# EAGLE board Gameboy Player (EAGLE 9.5.2)
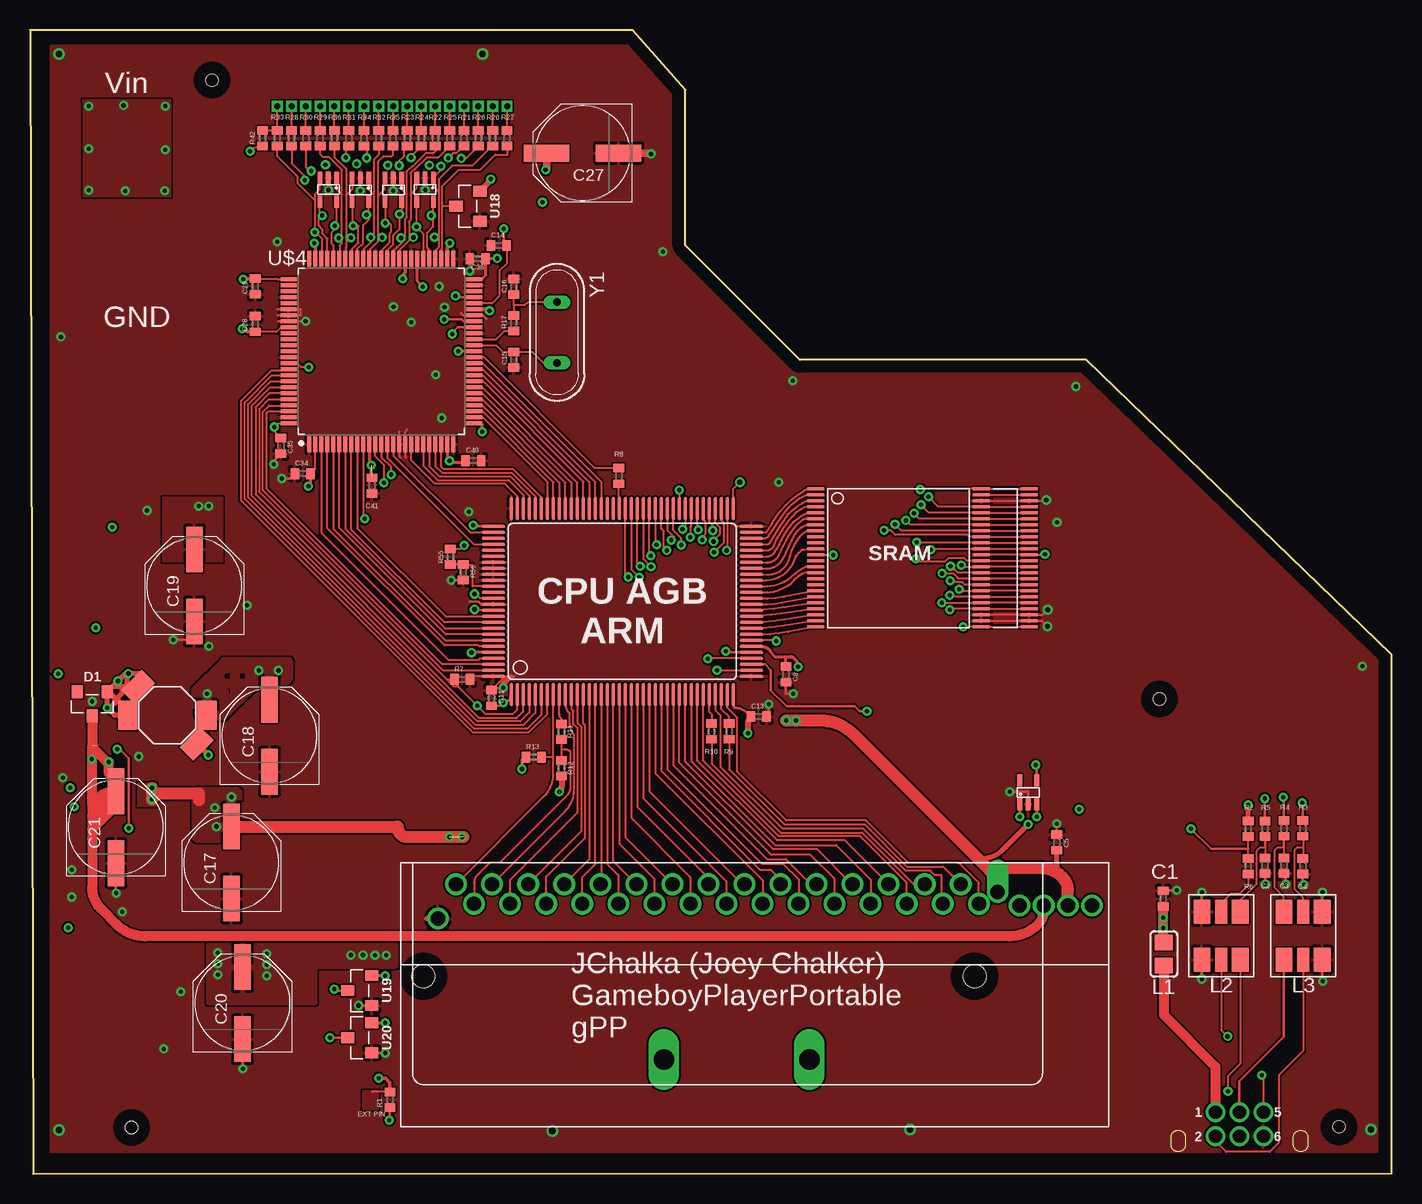
[diagram p2: board, top side]
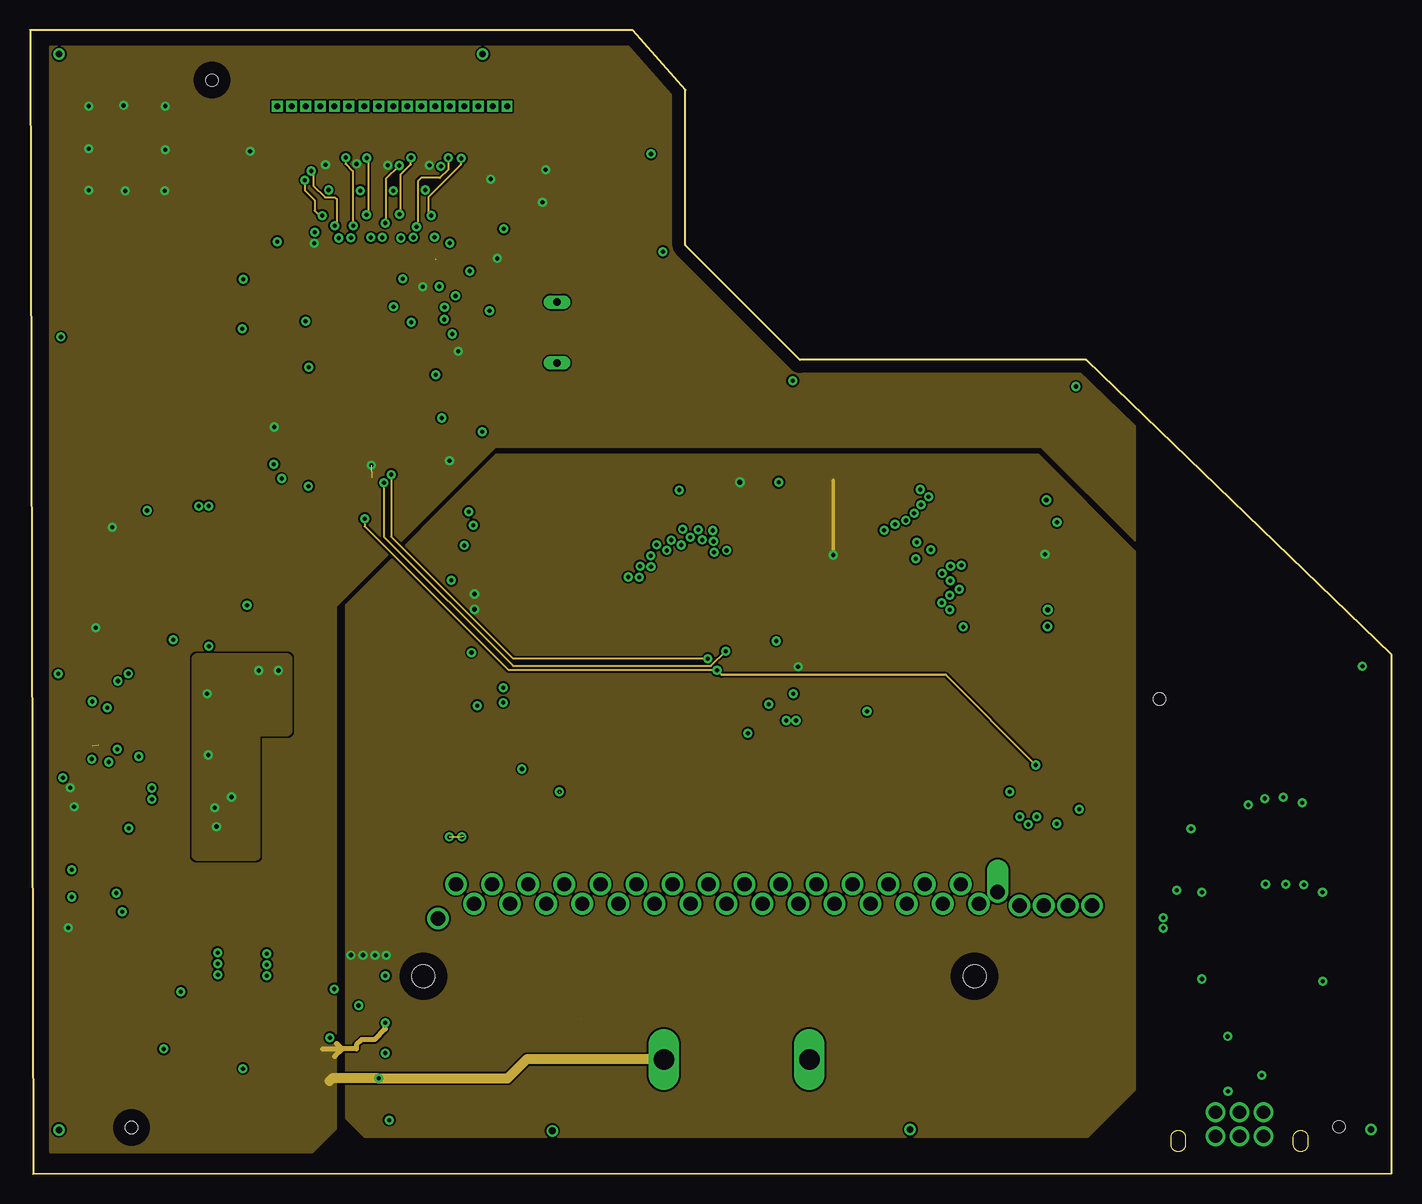
[diagram p3: board, inner layer Route2]
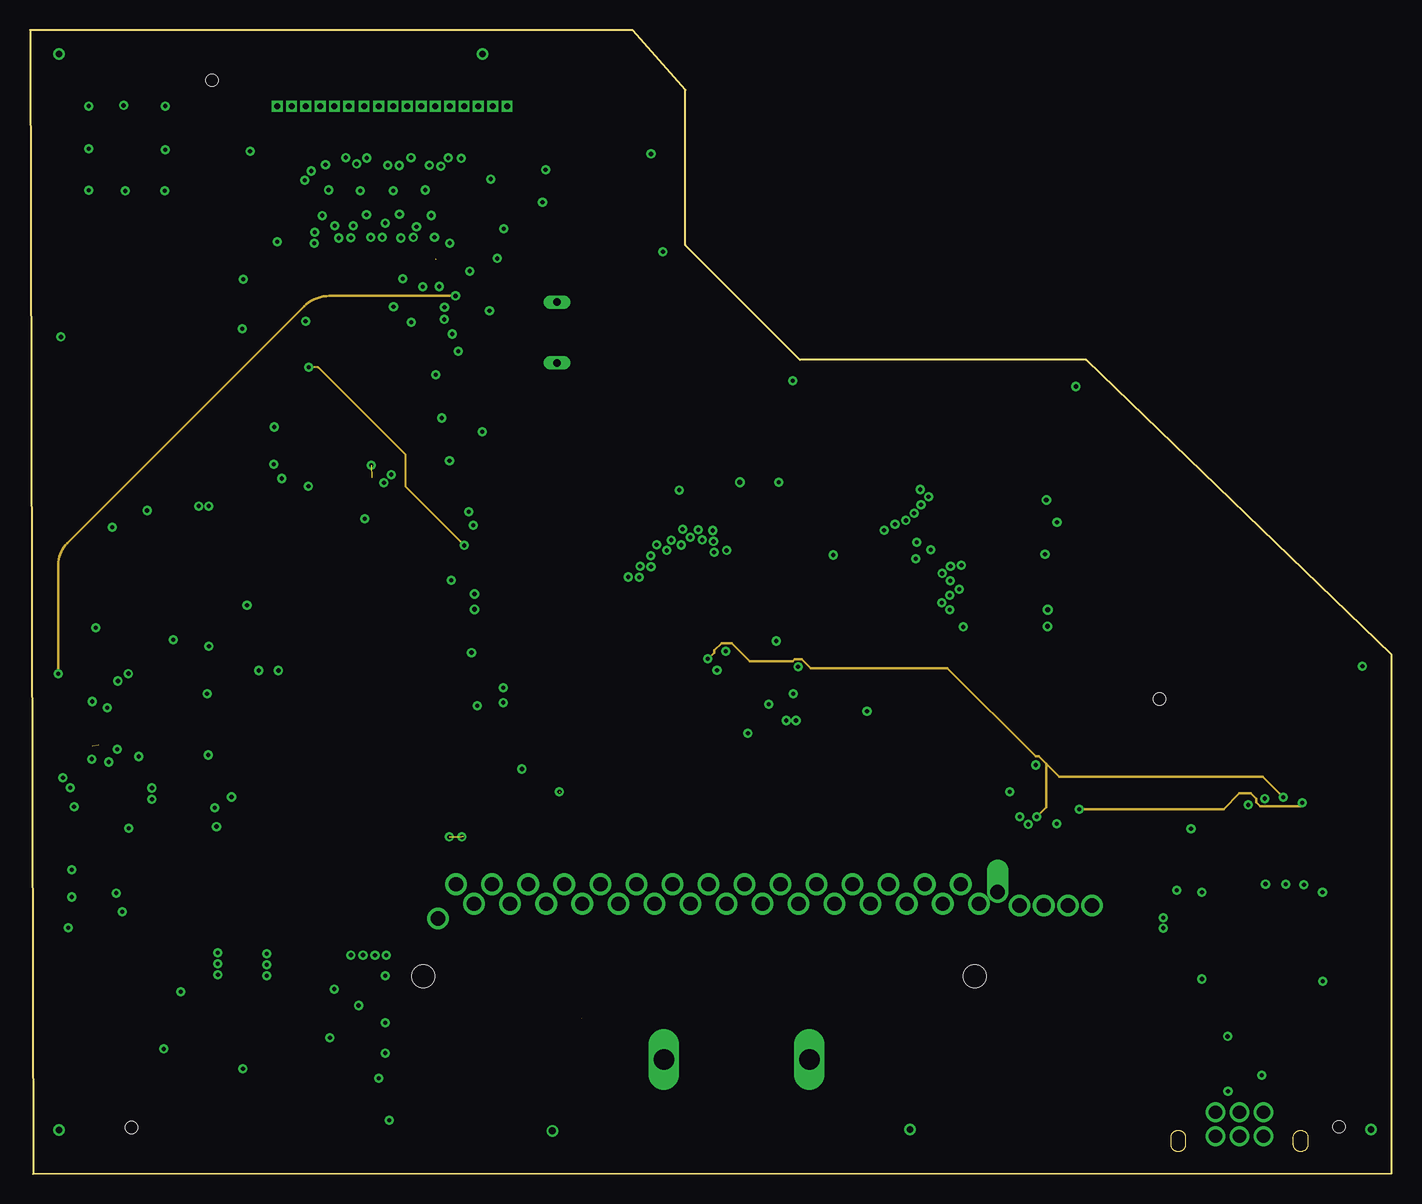
[diagram p4: board, inner layer Route15]
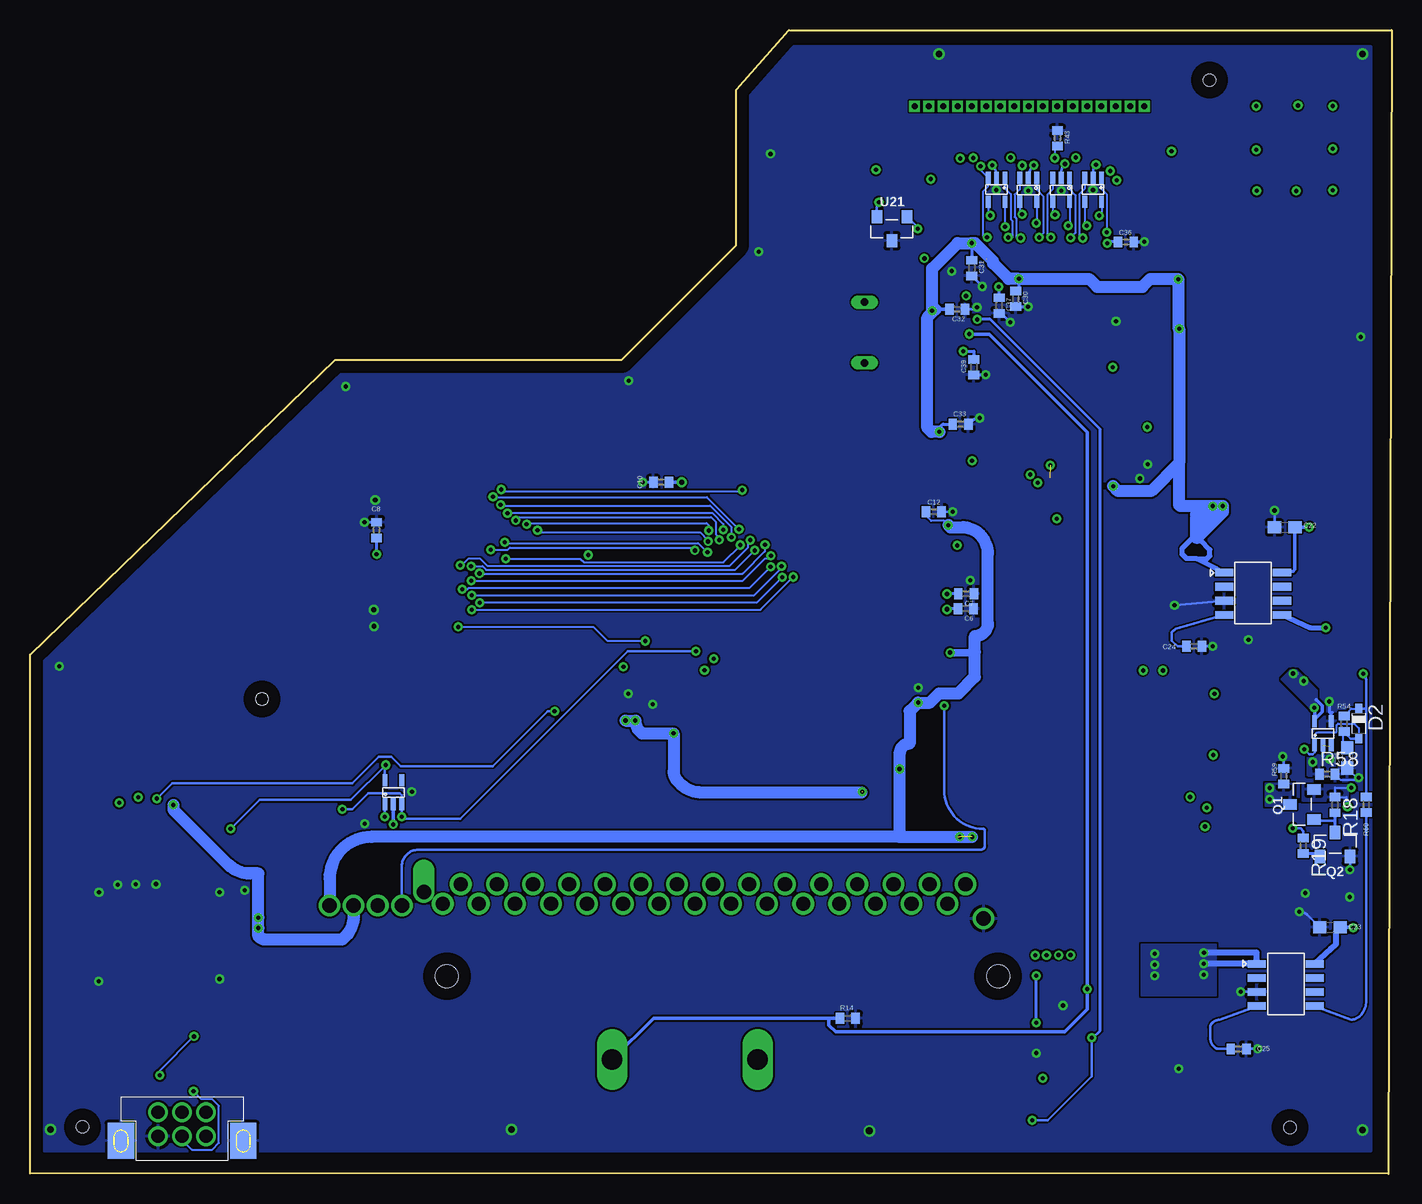
[diagram p5: board, bottom side, seen from below]

Size 113.46 x 95.31 mm. Coordinates in mm from the lower left corner, seen from the top.
Outline: 0.25,0 113.46,0.04 113.46,43.27 88.01,67.83 64.16,67.83 54.61,77.38 54.61,90.32 50.22,95.31 0,95.3 0.25,0
Copper layers (1+2*15+16): Top 0.035mm / dielectric 1.5mm / Route2 0.035mm / dielectric 0.15mm / Route15 0.035mm / dielectric 0.2mm / Bottom 0.035mm
Design rules "default *": minimum track width 6mil, minimum drill 0.35mm, track to track 6mil, track to pad 6mil, pad to pad 6mil, via to via 6mil, smd to smd 6mil, copper to edge 40mil, drill to drill 6mil, minimum pad ring 10mil, minimum via ring 8mil, stop-mask expansion 4mil, vias tented up to drill 20mil, thermal gap 10mil
Holes 1 mm at 15.16,91.14 94.13,39.56 8.46,3.86 109.08,3.91

## Footprints (pad centres in the part's own frame; a part is rotated, then mirrored left to right if it is on the bottom)
C0402 = smd 0.7 x 0.9: 1 -0.65,0; 2 0.65,0
PANASONIC_E = smd 3.8 x 1.4: + 3,0; - -3,0
C0603 = smd 1.1 x 1: 1 -0.85,0; 2 0.85,0
GBA-SMD-DIODE-PLACEHOLDER = smd 0.9 x 1.1: P$1 0,1; P$2 -1.25,-1; P$3 1.25,-1
SOD323_ST = smd 0.8 x 0.6: A 1.25,0; C -1.25,0
Z0805 = smd 1.3 x 1.5: 1 -0.95,0; 2 0.95,0
GBA-TRIPLE-EMI-FILTER = smd 2 x 1.4: 1IN -2,1.6; 1OUT 2,1.6; 3IN -2,-1.6; 3OUT 2,-1.6 | smd 2 x 1: 2IN -2,0; 2OUT 2,0
GBA-INDUCTOR = smd 2.4 x 1.6 rotated 135: 1@1 2.375,2.425 | smd 2.4 x 1.6: 1@2 0,3.3; 2@2 0,-3.3 | smd 2.4 x 1.6 rotated 315: 2@1 -2.375,-2.425
R0402 = smd 0.7 x 0.9: 1 -0.65,0; 2 0.65,0
GBA-TRANSFORMER = smd 0.635 x 1.524: 1 -1.757,-2.414; 2 -0.586,-2.414; 3 0.585,-2.414; 4 1.757,-2.414; 5 1.757,2.414; 6 0.585,2.414; 7 -0.586,2.414; 8 -1.757,2.414
GBA-AGB-U10 = smd 0.4 x 1: 1 -0.7,-1; 2 0,-1; 3 0.7,-1; 4 0.7,1; 5 -0.7,1
TSOP48-SRAM = smd 1.422 x 0.254: 1 0,0; 2 0,-0.5; 3 0,-1; 4 0,-1.5; 5 0,-2; 6 0,-2.5; 7 0,-3; 8 0,-3.5; 9 0,-4; 10 0,-4.5; 11 0,-5; 12 0,-5.5; 13 0,-6; 14 0,-6.5; 15 0,-7; 16 0,-7.5; 17 0,-8; 18 0,-8.5; 19 0,-9; 20 0,-9.5; 21 0,-10; 22 0,-10.5; 23 0,-11; 24 0,-11.5; 25@1 17.8,-11.5; 25@2 13.8,-11.5; 26@1 17.8,-11; 26@2 13.8,-11; 27@1 17.8,-10.5; 27@2 13.8,-10.5; 28@1 17.8,-10; 28@2 13.8,-10; 29@1 17.8,-9.5; 29@2 13.8,-9.5; 30@1 17.8,-9; 30@2 13.8,-9; 31@1 17.8,-8.5; 31@2 13.8,-8.5; 32@1 17.8,-8; 32@2 13.8,-8; 33@1 17.8,-7.5; 33@2 13.8,-7.5; 34@1 17.8,-7; 34@2 13.8,-7; 35@1 17.8,-6.5; 35@2 13.8,-6.5; 36@1 17.8,-6; 36@2 13.8,-6; 37@1 17.8,-5.5; 37@2 13.8,-5.5; 38@1 17.8,-5; 38@2 13.8,-5; 39@1 17.8,-4.5; 39@2 13.8,-4.5; 40@1 17.8,-4; 40@2 13.8,-4; 41@1 17.8,-3.5; 41@2 13.8,-3.5; 42@1 17.8,-3; 42@2 13.8,-3; 43@1 17.8,-2.5; 43@2 13.8,-2.5; 44@1 17.8,-2; 44@2 13.8,-2; 45@1 17.8,-1.5; 45@2 13.8,-1.5; 46@1 17.8,-1; 46@2 13.8,-1; 47@1 17.8,-0.5; 47@2 13.8,-0.5; 48@1 17.8,0; 48@2 13.8,0
CARTSLOT-DOL-17 = drill 1.2 pad 1.422 offset: 1 45.122,-0.653 | drill 1.2: 2 43.558,-1.629; 3 42.056,0; 4 40.554,-1.629; 5 39.052,0; 6 37.55,-1.629; 7 36.048,0; 8 34.546,-1.629; 9 33.044,0; 10 31.542,-1.629; 11 30.04,0; 12 28.538,-1.629; 13 27.036,0; 14 25.534,-1.629; 15 24.032,0; 16 22.53,-1.629; 17 21.028,0; 18 19.526,-1.629; 19 18.024,0; 20 16.522,-1.629; 21 15.02,0; 22 13.518,-1.629; 23 12.016,0; 24 10.514,-1.629; 25 9.012,0; 26 7.51,-1.629; 27 6.008,0; 28 4.506,-1.629; 29 3.004,0; 30 1.502,-1.629; 31 0,0; 32 -1.513,-2.859; C1 50.982,-1.77; C2 46.964,-1.77; S1 52.991,-1.77; S2 48.973,-1.77 | drill 1.7 long: CARTSW1 29.439,-14.599; CARTSW2 17.323,-14.599 | hole 1.9: 43.204,-7.675; -2.719,-7.675
CPU-AGB-LQFP128 = smd 2 x 0.254: 1 -7,9.5; 2 -7,9; 3 -7,8.5; 4 -7,8; 5 -7,7.5; 6 -7,7; 7 -7,6.5; 8 -7,6; 9 -7,5.5; 10 -7,5; 11 -7,4.5; 12 -7,4; 13 -7,3.5; 14 -7,3; 15 -7,2.5; 16 -7,2; 17 -7,1.5; 18 -7,1; 19 -7,0.5; 20 -7,0; 21 -7,-0.5; 22 -7,-1; 23 -7,-1.5; 24 -7,-2; 25 -7,-2.5; 26 -7,-3; 27 -7,-3.5; 28 -7,-4; 29 -7,-4.5; 30 -7,-5; 31 -7,-5.5; 32 -7,-6; 33 -7,-6.5; 34 -7,-7; 35 -7,-7.5; 36 -7,-8; 37 -7,-8.5; 38 -7,-9; 65 8.5,-9; 66 8.5,-8.5; 67 8.5,-8; 68 8.5,-7.5; 69 8.5,-7; 70 8.5,-6.5; 71 8.5,-6; 72 8.5,-5.5; 73 8.5,-5; 74 8.5,-4.5; 75 8.5,-4; 76 8.5,-3.5; 77 8.5,-3; 78 8.5,-2.5; 79 8.5,-2; 80 8.5,-1.5; 81 8.5,-1; 82 8.5,-0.5; 83 8.5,0; 84 8.5,0.5; 85 8.5,1; 86 8.5,1.5; 87 8.5,2; 88 8.5,2.5; 89 8.5,3; 90 8.5,3.5; 91 8.5,4; 92 8.5,4.5; 93 8.5,5; 94 8.5,5.5; 95 8.5,6; 96 8.5,6.5; 97 8.5,7; 98 8.5,7.5; 99 8.5,8; 100 8.5,8.5; 101 8.5,9; 102 8.5,9.5 | smd 0.254 x 2: 39 -5.5,-10.5; 40 -5,-10.5; 41 -4.5,-10.5; 42 -4,-10.5; 43 -3.5,-10.5; 44 -3,-10.5; 45 -2.5,-10.5; 46 -2,-10.5; 47 -1.5,-10.5; 48 -1,-10.5; 49 -0.5,-10.5; 50 0,-10.5; 51 0.5,-10.5; 52 1,-10.5; 53 1.5,-10.5; 54 2,-10.5; 55 2.5,-10.5; 56 3,-10.5; 57 3.5,-10.5; 58 4,-10.5; 59 4.5,-10.5; 60 5,-10.5; 61 5.5,-10.5; 62 6,-10.5; 63 6.5,-10.5; 64 7,-10.5; 103 7,11; 104 6.5,11; 105 6,11; 106 5.5,11; 107 5,11; 108 4.5,11; 109 4,11; 110 3.5,11; 111 3,11; 112 2.5,11; 113 2,11; 114 1.5,11; 115 1,11; 116 0.5,11; 117 0,11; 118 -0.5,11; 119 -1,11; 120 -1.5,11; 121 -2,11; 122 -2.5,11; 123 -3,11; 124 -3.5,11; 125 -4,11; 126 -4.5,11; 127 -5,11; 128 -5.5,11
EXT-PORT-AGB = drill 1.1: 1 -2,0; 2 -2,2; 3 0,0; 4 0,2; 5 2,0; 6 2,2 | smd 2.2 x 3: GND@1 -5.1,2.4; GND@2 5.1,2.4
QFP50P1601X1601X120-100N = smd 1.347 x 0.324: 1 -7.733,6; 2 -7.733,5.5; 3 -7.733,5; 4 -7.733,4.5; 5 -7.733,4; 6 -7.733,3.5; 7 -7.733,3; 8 -7.733,2.5; 9 -7.733,2; 10 -7.733,1.5; 11 -7.733,1; 12 -7.733,0.5; 13 -7.733,0; 14 -7.733,-0.5; 15 -7.733,-1; 16 -7.733,-1.5; 17 -7.733,-2; 18 -7.733,-2.5; 19 -7.733,-3; 20 -7.733,-3.5; 21 -7.733,-4; 22 -7.733,-4.5; 23 -7.733,-5; 24 -7.733,-5.5; 25 -7.733,-6; 51 7.733,-6; 52 7.733,-5.5; 53 7.733,-5; 54 7.733,-4.5; 55 7.733,-4; 56 7.733,-3.5; 57 7.733,-3; 58 7.733,-2.5; 59 7.733,-2; 60 7.733,-1.5; 61 7.733,-1; 62 7.733,-0.5; 63 7.733,0; 64 7.733,0.5; 65 7.733,1; 66 7.733,1.5; 67 7.733,2; 68 7.733,2.5; 69 7.733,3; 70 7.733,3.5; 71 7.733,4; 72 7.733,4.5; 73 7.733,5; 74 7.733,5.5; 75 7.733,6 | smd 0.324 x 1.347: 26 -6,-7.733; 27 -5.5,-7.733; 28 -5,-7.733; 29 -4.5,-7.733; 30 -4,-7.733; 31 -3.5,-7.733; 32 -3,-7.733; 33 -2.5,-7.733; 34 -2,-7.733; 35 -1.5,-7.733; 36 -1,-7.733; 37 -0.5,-7.733; 38 0,-7.733; 39 0.5,-7.733; 40 1,-7.733; 41 1.5,-7.733; 42 2,-7.733; 43 2.5,-7.733; 44 3,-7.733; 45 3.5,-7.733; 46 4,-7.733; 47 4.5,-7.733; 48 5,-7.733; 49 5.5,-7.733; 50 6,-7.733; 76 6,7.733; 77 5.5,7.733; 78 5,7.733; 79 4.5,7.733; 80 4,7.733; 81 3.5,7.733; 82 3,7.733; 83 2.5,7.733; 84 2,7.733; 85 1.5,7.733; 86 1,7.733; 87 0.5,7.733; 88 0,7.733; 89 -0.5,7.733; 90 -1,7.733; 91 -1.5,7.733; 92 -2,7.733; 93 -2.5,7.733; 94 -3,7.733; 95 -3.5,7.733; 96 -4,7.733; 97 -4.5,7.733; 98 -5,7.733; 99 -5.5,7.733; 100 -6,7.733
QS = drill 0.61 long: 1 -2.54,0; 2 2.54,0

## Placement (x,y rotation side)
C1  [C0402]  94.44,22.94 270 top
C2  [C0402]  102.92,25.68 270 top
C3  [C0402]  104.5,25.68 270 top
C4  [C0402]  106.07,25.63 270 top
C5  [C0402]  85.57,27.61 270 top
C6  [C0402]  35.48,47.09 180 bottom
C7  [C0402]  35.46,48.34 180 bottom
C8  [C0402]  84.58,53.64 90 bottom
C9  [C0402]  62.99,41.61 270 top
C10  [C0402]  60.86,57.63 180 bottom
C11  [C0402]  38.46,39.65 270 top
C12  [C0402]  38.15,55.17 180 bottom
C13  [C0402]  60.73,38.1 0 top
C14  [C0402]  39.07,77.36 0 top
C15  [C0402]  40.31,67.84 270 top
C16  [C0402]  40.31,73.91 90 top
C17  33μF  [PANASONIC_E]  16.79,25.93 90 top
C18  33μF  [PANASONIC_E]  19.96,36.5 90 top
C19  100μF  [PANASONIC_E]  13.7,49.02 90 top
C20  33μF  [PANASONIC_E]  17.72,14.22 90 top
C21  33μF  [PANASONIC_E]  7.16,28.88 90 top
C22  [C0603]  8.9,53.87 0 bottom
C23  [C0603]  5.13,20.54 0 bottom
C24  [C0402]  16.45,43.95 0 bottom
C25  [C0402]  12.75,10.4 0 bottom
C26  [C0603]  3.71,34.66 270 bottom
C27  220μF  [PANASONIC_E]  46.05,85.05 180 top
C28  [C0402]  18.77,70.82 90 top
C29  [C0402]  18.77,73.94 90 top
C30  [C0402]  31.32,72.91 270 bottom
C31  [C0402]  34.98,75.48 270 bottom
C32  [C0402]  36.18,72.05 180 bottom
C33  [C0402]  35.92,62.47 0 bottom
C34  [C0402]  22.72,58.34 0 top
C35  [C0402]  20.9,60.66 270 top
C36  [C0402]  22.14,77.65 180 bottom
C37  [C0402]  32.7,72.35 270 bottom
C38  [C0402]  37.3,76.25 0 top
C39  [C0402]  34.81,67.22 90 bottom
C40  [C0402]  36.96,59.42 0 top
C41  [C0402]  28.5,57.35 270 top
D1  GBA-SMD-DIODE-PLACEHOLDER  [GBA-SMD-DIODE-PLACEHOLDER]  5.18,39.17 180 top
D2  BAT60J  [SOD323_ST]  2.73,37.52 270 bottom
L1  EM0805  [Z0805]  94.49,18.31 270 top
L2  GBA-TRIPLE-EMI-FILTER  [GBA-TRIPLE-EMI-FILTER]  99.26,19.84 270 top
L3  GBA-TRIPLE-EMI-FILTER  [GBA-TRIPLE-EMI-FILTER]  106.1,19.84 270 top
L4  GBA-INDUCTOR  [GBA-INDUCTOR]  11.46,38.2 270 top
Q1  GBA-SMD-DIODE-PLACEHOLDER  [GBA-SMD-DIODE-PLACEHOLDER]  7.45,30.77 90 bottom
Q2  GBA-SMD-DIODE-PLACEHOLDER  [GBA-SMD-DIODE-PLACEHOLDER]  4.71,27.44 0 bottom
R1  [R0402]  30,6.17 90 top
R2  [R0402]  101.52,28.75 90 top
R3  [R0402]  106.07,28.78 90 top
R4  [R0402]  104.5,28.78 90 top
R5  [R0402]  102.92,28.75 90 top
R6  [R0402]  101.52,25.63 90 top
R7  [R0402]  36.02,41.2 0 top
R8  [R0402]  49.07,58.15 90 top
R9  [R0402]  58.27,36.86 90 top
R10  [R0402]  56.79,36.86 90 top
R11  [R0402]  44.3,36.83 90 top
R12  [R0402]  44.3,33.78 90 top
R13  [R0402]  41.99,34.72 0 top
R14  [R0402]  45.31,12.95 0 bottom
R17  [R0402]  40.31,70.87 90 top
R18  [R0402]  4.71,30.73 270 bottom
R19  [R0402]  7.35,27.34 270 bottom
R20  [R0402]  38.56,86.28 90 top
R21  [R0402]  36.17,86.28 90 top
R22  [R0402]  33.78,86.28 90 top
R23  [R0402]  31.45,86.28 90 top
R24  [R0402]  32.61,86.28 90 top
R25  [R0402]  34.98,86.28 90 top
R26  [R0402]  37.36,86.28 90 top
R27  [R0402]  39.75,86.28 90 top
R28  [R0402]  21.79,86.28 90 top
R29  [R0402]  24.18,86.28 90 top
R30  [R0402]  22.99,86.28 90 top
R31  [R0402]  26.57,86.28 90 top
R32  [R0402]  29.06,86.28 90 top
R33  [R0402]  20.6,86.28 90 top
R34  [R0402]  27.84,86.28 90 top
R35  [R0402]  30.25,86.28 90 top
R36  [R0402]  25.37,86.28 90 top
R42  [R0402]  19.38,86.28 270 top
R43  [R0402]  27.84,86.28 270 bottom
R54  [R0402]  3.95,37.5 90 bottom
R55  [R0402]  35.03,51.42 270 top
R56  [R0402]  36.11,50.11 270 top
R58  [R0402]  5.36,33.3 0 bottom
R59  [R0402]  8.98,33.13 270 bottom
R60  [R0402]  2.11,30.76 270 bottom
U5  GBA-TRANSFORMER  [GBA-TRANSFORMER]  11.53,48.34 270 bottom
U7  GBA-AGB-U10  [GBA-AGB-U10]  5.71,36.7 0 bottom
U8  GBA-AGB-U10  [GBA-AGB-U10]  83.19,31.78 0 bottom
U9  GBA-AGB-U10  [GBA-AGB-U10]  83.19,31.78 0 top
U10  GBA-AGB-U10  [GBA-AGB-U10]  32.92,82.02 180 bottom
U12  GBA-AGB-U10  [GBA-AGB-U10]  30.28,81.99 180 bottom
U14  GBA-AGB-U10  [GBA-AGB-U10]  27.53,81.99 180 bottom
U16  GBA-AGB-U10  [GBA-AGB-U10]  24.87,82.02 180 bottom
U18  GBA-SMD-DIODE-PLACEHOLDER  [GBA-SMD-DIODE-PLACEHOLDER]  36.5,80.63 90 top
U19  GBA-SMD-DIODE-PLACEHOLDER  [GBA-SMD-DIODE-PLACEHOLDER]  27.48,15.27 90 top
U20  GBA-SMD-DIODE-PLACEHOLDER  [GBA-SMD-DIODE-PLACEHOLDER]  27.48,11.33 90 top
U21  GBA-SMD-DIODE-PLACEHOLDER  [GBA-SMD-DIODE-PLACEHOLDER]  41.63,78.75 180 bottom
U69  TSOP48-SRAM  [TSOP48-SRAM]  65.48,57.1 0 top
U$1  CARTSLOT-DOL-17  [CARTSLOT-DOL-17]  35.51,24.13 0 top
U$2  CPU-AGB-LQFP128  [CPU-AGB-LQFP128]  49.61,46.94 90 top
U$3  EXT-PORT-AGB  [EXT-PORT-AGB]  100.79,5.13 180 bottom
U$4  REFQFP100  [QFP50P1601X1601X120-100N]  29.29,68.53 90 top
U$6  GBA-TRANSFORMER  [GBA-TRANSFORMER]  8.81,15.74 270 bottom
U$11  GBA-AGB-U10  [GBA-AGB-U10]  32.92,82.02 180 top
U$13  GBA-AGB-U10  [GBA-AGB-U10]  30.28,81.99 180 top
U$15  GBA-AGB-U10  [GBA-AGB-U10]  27.53,81.99 180 top
U$17  GBA-AGB-U10  [GBA-AGB-U10]  24.87,82.02 180 top
Y1  [QS]  43.92,70.1 270 top

## Tracks (layer width: path | path; a pad name or v marks a point on that pad's centre or on a via)
C2  (via drill 0.35)
  Top 0.152: U$4.96 19.9,64.53 19.1,63.73 19.1,56.85 34.75,41.2 | U$2.2 40.61,38.68 40.28,38.35 37.92,38.35 v37.28,39 | 34.75,41.2 R7.1 | 35.68,40.6 35.35,40.6 34.75,41.2
  Top 0.203: v37.28,39 35.68,40.6 35.37,40.91 R7.1
  Bottom 0.203: U$1.C2 82.47,25.63 arc90 81.1,27 34.24,27 arc-90 33.88,27.36 33.88,28.59 arc-90 34.04,28.74 arc90 37.28,31.98 v37.28,39
C14  (via drill 0.35)
  Top 0.152: C14.2 39.72,75.83 39.12,75.23 39.12,73.13 38.52,72.53 U$4.46
  Top 0.203: v39.48,78.74 39.48,77.91 arc45 C14.2
  Bottom 0.203: U21.P$2 39.57,78.94 arc45 v39.48,78.74
CK1  (via drill 0.35)
  Top 0.152: v36.18,52.36 35.89,52.07 R55.1 | v23.23,67.21 22.6,67.21 22.28,67.53 U$4.90
  Route15 0.152: v36.18,52.36 31.29,57.25 31.29,59.92 24,67.21 v23.23,67.21
GBPV  (via drill 0.35)  (1 unrouted)
  Top 0.152: U$4.100 21.51,62.48 20.6,62.48 v20.35,62.23 20.35,61.86 C35.1 | R42.2 18.59,85.46 v18.34,85.2 | R1.2 28.51,6.82
  Top 0.254: U20.P$3 v29.61,12.58 v29.62,12.57 | v29.62,16.51 U19.P$3 | v23.7,77.55 23.79,77.46 U$4.74 | U$4.38 35.71,68.53 v35.69,68.55 | v32.74,73.93 32.29,74.38 U$4.57 | U$4.50 37.64,74.53 37.99,74.88 37.99,76.21 C38.2 37.98,76.28 v38.93,76.28 | U$4.24 34.79,59.59 v34.96,59.42 35.1,59.27 36.13,59.27 36.28,59.42 C40.1 | U$4.11 28.29,59.32 28.44,59.17 28.44,58.06 C41.1
  Top 0.305: R1.2 30,7.59 29.64,7.95 v29.06,7.95
  Top 0.508: U18.P$3 38.33,82.71 arc45 v38.41,82.89
  Top 0.61: C27.+ 43.05,83.75 v42.96,83.67
  Route2 0.406: 26.04,10.41 27.2,10.41 27.2,10.74 27.64,11.18 28.73,11.18 29.62,12.06 v29.62,12.57 | 24.38,10.41 26.04,10.41 | 26.01,10.39 25.55,10.85 | 26.04,10.41 26.01,10.39 | 26.01,10.39 25.4,9.78 25.37,9.78
  Route2 0.813: 24.97,7.75 25.17,7.95 v29.06,7.95 39.8,7.95 41.38,9.53 U$1.CARTSW2
  Bottom 0.152: v3.35,32.17 4.71,32.17 R18.1 3.76,31.38 3.76,30.58 v3.67,30.58
  Bottom 0.203: U21.P$3 42.88,80.55 arc45 v42.71,80.96 | U16.2 24.87,83.49 arc45 v24.63,84.07 | U14.2 27.53,83.38 arc45 v27.22,84.15 | U12.2 arc45 29.85,84.02 v29.82,84.05 | U10.2 32.92,83.15 arc-45 v33.29,84.04
  Bottom 0.254: v29.62,12.57 v29.62,16.51 | C36.2 23.6,77.65 v23.7,77.55 | v35.69,68.55 34.81,68.55 C39.2 | C37.1 32.7,73.91 32.72,73.93 v32.74,73.93
  Bottom 0.305: v6.85,53.89 6.86,53.87 C22.2 8.05,50.37 8.2,50.22 U5.8 | C23.2 3.19,20.54 v3.19,20.51
  Bottom 0.406: U5.5 6.76,45.5 v5.49,45.5
  Bottom 0.508: U$6.8 5.04,18.77 4.61,19.13 4.61,20.21 C23.2
  other vias: 28.44,59.04 4.89,85.42 4.89,81.95 7.94,81.9 11.23,81.92 11.26,85.34 11.26,88.98 7.8,89.03 4.89,88.98
  pour Route2 (rank 2): 25.5,47.29 38.81,60.6 84.23,60.6 92.1,52.73 92.1,93.93 1.65,93.93 1.65,1.8 23.57,1.8 25.5,3.73
  pour Bottom (rank 2): 4.25,31.05 7.39,31.05 7.39,32.28 7.39,32.42 3.66,32.42 3.66,31.05
  pour Top (rank 2): 28.78,6.88 27.75,6.88 27.75,5.99 27.75,5.38 29.03,5.38 29.03,6.88 28.79,6.88
  pour Top: 4.95,89.47 4.42,89.47 4.42,89.41 4.42,81.45 4.95,81.45 11.72,81.45 11.72,81.99 11.72,89.47 4.97,89.47
GBPV2  (via drill 0.35)
  Top 0.152: C29.2 20.53,74.59 20.59,74.53 U$4.76 | U$4.84 20.89,70.52 20.53,70.17 C28.1 | C34.2 23.79,58.76 U$4.2
  Top 0.254: U$4.26 37.45,62.53 37.66,62.44 arc-45 37.68,62.43 v37.68,61.83 | C34.2 23.37,57.71 arc-45 v23.2,57.3
  Top 0.305: C29.2 17.9,74.59 arc45 v17.77,74.54 | C28.1 18.31,70.17 arc-45 v17.69,70.42 | U$4.59 31.29,75.14 arc45 v31.05,74.57 | U$4.52 34.79,77.07 arc-45 v34.99,77.56 | U$4.45 38.03,72.03 arc-45 v38.29,71.92
  Bottom 0.254: v34.99,77.56 34.99,76.16 arc-45 C31.1 | v37.68,61.83 37.68,61.85 arc45 37.44,62.43 arc45 37.35,62.47 C33.1 | C30.1 31.05,73.83 v31.05,74.57
  Bottom 0.305: v38.29,71.92 arc45 38.01,72.03 36.85,72.03 C32.2
  Bottom 0.406: 16.23,52.96 16.6,52.96 17.45,52.11 17.45,51.63 17.11,51.29 16.28,51.29 U5.1 16.22,51.25 15.39,51.25 15.14,51.5 15.14,52.02 15.85,52.73 15.85,53.19
  Bottom 1.016: v37.68,61.83 38.34,61.83 38.68,62.17 38.68,71.36 38.01,72.03 | v38.29,71.92 38.29,75.43 36.16,77.56 v34.99,77.56 34.7,77.56 33.2,76.06 33.2,75.87 31.9,74.57 v31.05,74.57 25.21,74.57 24.54,73.9 20.76,73.9 20.09,74.57 17.81,74.57 v17.77,74.54 17.77,70.5 v17.69,70.42 17.69,59.25 | v23.2,57.3 22.8,56.9 20.04,56.9 17.69,59.25 | 15.41,53.78 16.23,52.96 16.29,53.02 16.29,54.66 | 15.15,54.04 14.06,55.13 v14.06,55.64 17.59,55.64 17.69,55.74 17.69,59.25 | 15.41,53.78 15.15,54.04 | 15.15,54.04 15.15,54.93 16.29,54.93 16.29,54.66 | 16.29,54.66 15.41,53.78
  other vias: 14.9,55.64
  pour Top: 16.04,56.31 11.09,56.31 11.09,51.07 16.04,51.07
GND  (via drill 0.35, 0.4, 0.55)
  Top 0.152: U69.46@2 U69.46@1 84.65,56.1 v84.7,56.15 | U69.27@2 U69.27@1 84.41,46.6 v84.81,47 | U69.26@2 U69.26@1 84.32,46.1 v84.8,45.62 | R56.2 v35.12,49.46 v35.12,49.45 | U$2.128 36.91,41.44 R7.2 | 40.36,41.45 40.11,41.45 39.61,41.45 C11.1 38.66,40.5 v39.45,40.5 | U$2.116 37.59,47.44 37.35,47.68 36.63,47.68 | U$2.64 58.87,53.94 58.84,53.91 58.84,52.21 | 31.32,59.7 31.29,59.73 U$4.17 31.29,61.86 31.43,62 | 30.87,59.68 30.79,59.76 U$4.16 30.79,61.85 30.77,61.86 | 20.63,71.53 U$4.82 22.57,71.53 22.57,72.03 U$4.81 20.64,72.03 20.61,72.06 | U$4.83 20.67,71.03 20.65,71.01 | U$4.83 22.59,71.03 | 35.92,71.72 36.1,71.53 U$4.44 37.72,71.53 38.02,71.22 | U$17.2 24.87,81.99 v24.88,81.98 | U$15.2 27.52,82.98 v27.52,81.91 | U$13.2 v30.26,81.91 | U$11.2 32.92,81.99 v32.93,81.98 | U$4.83 22.96,71.03 v22.96,71.04
  Top 0.203: C20.- 17.72,8.76 v17.74,8.76 | C21.- 7.16,23.39 v7.19,23.39 | C19.- 13.7,44.5 v11.93,44.5 | C9.2 62.99,40 v63.61,40 | C13.2 61.56,38.1 v61.56,39.13 | U9.2 83.19,31.83 v81.64,31.83 | C5.1 v85.57,29.16 | C1.1 94.44,23.62 v95.57,23.62 | L2.3IN v97.66,23.47 | v97.66,23.47 | L2.3OUT v97.66,16.23 | v97.66,16.23 | L3.1OUT 107.7,16.04 v107.73,16.04 | L3.1IN v107.7,23.46 v107.71,23.46 | C4.2 106.07,24.08 v106.16,24.08 | C3.2 104.65,25.03 v104.65,24.12 | C2.2 102.92,24.14 v102.96,24.14 | U20.P$2 29.62,10.08 v29.62,10.06 | U19.P$2 v27.38,14.02
  Top 0.254: C34.1 21.66,57.94 v20.97,57.94 | C35.2 20.53,59.63 arc45 v20.32,59.13 | C38.1 v36.65,75.22
  Top 0.406: 40.11,41.45 39.95,41.29 39.91,41.29 39.45,40.83 v39.45,40.5 | U$1.32 33.06,21.27
  Top 0.61: C27.- 51.69,85.05 v51.75,84.99
  Bottom 0.152: C26.2 2.9,32.99 v2.74,32.99 2.88,32.85 4.27,32.85 R58.2 | C12.1 v36.56,55.17
  Bottom 0.203: C32.1 34.91,72.05 arc-45 v34.54,72.2 | C25.2 v11.14,10.4 | C23.1 7.01,21.56 arc-45 v7.68,21.84 | Q2.P$3 v3.46,25.35 arc45 v3.47,25.34 | R58.2 4.54,33.3 | R59.1 8.98,34.59 arc-45 v9.06,34.77 | U$6.3 12.31,15.15 12.43,15.02 12.43,15.1 12.51,15.1 v12.57,15.16 | U5.3 v18.09,47.37 | v18.09,47.37 | C22.1 v9.75,55.27 | C24.2 14.91,43.95 v14.91,43.97 | C10.2 v62.4,57.63 | C8.2 v85.59,54.29
  Bottom 0.254: C31.2 34.11,73.96 arc-45 v34.1,73.94 | C33.2 35.07,62.67 arc45 v34.32,62.98 | U7.4 5.02,38.38 4.94,38.46 5.18,38.46 v5.18,39.36 | C30.2 v30.29,72.26 | C36.1 20.63,77.65 v20.6,77.67 | C39.1 33.84,66.57 v33.82,66.59 | C37.2 32.51,71.7 v31.76,70.95
  other vias: 111.76,3.68 2.41,3.66 2.43,93.31 37.72,93.31 43.52,3.58 73.34,3.68 63.56,66.09 52.74,76.83 111.04,42.29 87.16,65.61 3.48,23.06 2.58,69.74
  pour Top (rank 3): 1.73,93.94 1.73,1.87 112.29,1.87 112.29,93.94
  pour Bottom (rank 3): 1.73,93.94 1.73,1.88 112.29,1.88 112.29,93.94
N$1
  Top 0.152: U$4.36 37.73,67.53 47.61,57.65 U$2.87
N$2
  Top 0.152: U$2.88 47.11,57.64 37.72,67.03 U$4.35
N$3
  Top 0.152: U$4.34 37.71,66.53 46.61,57.64 U$2.89
N$4
  Top 0.152: U$2.90 46.11,57.68 37.76,66.03 U$4.33
N$5
  Top 0.152: U$2.91 45.61,57.6 37.68,65.53 U$4.32
N$6
  Top 0.152: U$4.31 37.68,65.03 45.11,57.6 U$2.92
N$7
  Top 0.152: U$2.93 44.61,57.6 37.68,64.53 U$4.30
N$8
  Top 0.152: U$4.29 37.68,64.03 37.92,63.79 37.92,63.78 44.11,57.6 U$2.94
N$9
  Top 0.152: U$2.95 43.61,57.64 37.72,63.53 U$4.28
N$10
  Top 0.152: U$4.27 37.73,63.03 43.11,57.66 U$2.96
N$11
  Top 0.152: U$2.97 42.61,56.38 40.26,58.72 34.47,58.72 34.29,58.91 U$4.23
N$12
  Top 0.152: U$4.22 33.79,58.97 34.34,58.42 40.13,58.42 42.11,56.44 U$2.98
N$13
  Top 0.152: U$4.21 33.29,58.94 34.11,58.12 40,58.12 41.61,56.51 U$2.99
N$14
  Top 0.152: U$4.20 32.79,59.01 33.99,57.81 39.88,57.81 41.11,56.58 U$2.100
N$15
  Top 0.152: U$2.101 40.61,56.47 39.57,57.51 33.73,57.51 31.79,59.45 U$4.18
N$16
  Top 0.152: U$4.15 30.29,59.83 36.68,53.44 U$2.104
N$17
  Top 0.152: U$4.14 29.79,59.65 36.99,52.44 U$2.106
N$18
  Top 0.152: U$4.39 38.84,69.03 39.38,68.49 C15.1 41.84,68.49 42.77,67.56 Y1.2
N$19
  Top 0.152: 79.26,56.6 83.3,56.6
N$20
  Top 0.152: U$4.95 19.94,65.03 18.8,63.88 18.8,56.62 37.41,38 40.56,38 41.11,38.54 U$2.3
N$21
  Top 0.152: U$2.4 41.61,38.46 40.84,37.69 37.29,37.69 18.49,56.49 18.49,64.01 20.01,65.53 U$4.94
N$22
  Top 0.152: U$2.5 42.11,38.4 41.1,37.39 37.16,37.39 18.19,56.36 18.19,64.13 20.08,66.03 U$4.93
N$23
  Top 0.152: U$2.6 42.61,38.24 41.45,37.08 37.04,37.08 17.88,56.24 17.88,64.26 20.15,66.53 U$4.92
N$24
  Top 0.152: U$4.91 21.44,66.92 20.11,66.92 17.58,64.39 17.58,56.11 36.91,36.78 41.58,36.78 43.11,38.31 U$2.7
N$25
  Top 0.152: U$4.97 19.93,64.02 19.41,63.5 19.41,56.97 34.45,41.93 U$2.127
N$26
  Top 0.152: U$2.126 34.37,42.44 19.71,57.1 19.71,63.37 19.87,63.53 U$4.98
N$27
  Top 0.152: U$4.3 24.29,53.41 34.89,42.81 37.34,42.81 37.46,42.94 U$2.125
N$28
  Top 0.152: U$2.123 38.59,43.95 37.44,43.95 37.35,44.04 34.55,44.04 24.79,53.8 U$4.4
N$29
  Top 0.152: U$4.5 25.29,53.76 34.61,44.44 U$2.122
N$30
  Top 0.152: U$2.121 34.67,44.94 25.79,53.82 U$4.6
N$31
  Top 0.152: U$4.7 26.29,53.75 34.6,45.44 U$2.120
N$32
  Top 0.152: U$2.119 34.53,45.94 26.79,53.68 U$4.8
N$33
  Top 0.152: U$4.9 27.29,53.79 34.68,46.4 38.57,46.4 U$2.118
N$34
  Top 0.152: U$2.84 49.07,55.47 R8.1
N$35
  Top 0.152: R8.2 47.06,58.8 37.84,68.03 U$4.37
N$39  (via drill 0.35)
  Top 0.152: v77.78,45.57 77.81,45.6 U69.25@2 U69.25@1 | v62.19,44.4 62.15,44.44 U$2.45
  Bottom 0.152: v77.78,45.57 66.52,45.57 65.35,44.4 v62.19,44.4
N$40
  Top 0.152: U69.24 63.2,45.16 arc-13 U$2.46
N$41
  Top 0.152: U69.23 62.81,45.67 arc-9 U$2.47
N$42
  Top 0.152: U69.22 62.81,46.18 arc-8 U$2.48
N$43
  Top 0.152: U69.21 62.56,46.69 arc-5 U$2.49
N$44
  Top 0.152: U69.20 62.94,47.19 arc-8 U$2.50
N$45
  Top 0.152: U69.19 62.69,47.57 arc-15 U$2.51
N$46
  Top 0.152: U69.18 62.81,48.08 arc-16 U$2.52
N$47
  Top 0.152: U$2.53 61.42,48.46 arc49 63.83,49.61 arc-66 U69.15
N$48
  Top 0.152: U$2.54 61.42,48.97 arc42 63.58,49.86 arc-16 64.47,50.5 arc-44 U69.14
N$49
  Top 0.152: U$2.55 61.42,49.48 arc68 63.7,51.13 arc-27 64.21,51.89 arc-32 64.47,52.02 arc-12 U69.11
N$50
  Top 0.152: U$2.56 61.52,49.94 arc77 63.3,51.33 arc-17 63.78,52.53 arc-8 64.24,53.19 arc-26 64.69,53.54 arc-41 U69.8
N$51
  Top 0.152: U$2.57 61.32,50.42 arc55 62.64,51.08 arc13 62.99,51.71 arc-7 63.78,53.31 arc-36 64.54,54 arc-36 U69.7
N$52
  Top 0.152: U$2.58 61.37,50.93 arc67 62.43,51.61 arc-5 62.94,52.63 arc-5 63.65,53.77 arc-21 64.38,54.49 arc-35 64.67,54.58 arc-10 64.86,54.6 U69.6
N$53
  Top 0.152: U$2.59 61.37,51.43 arc57 62.08,51.82 arc9 62.61,52.78 arc-18 63.53,54.18 arc-19 64.49,54.94 arc-39 U69.5
N$54
  Top 0.152: U$2.60 61.37,51.94 arc72 62.03,52.43 arc-15 62.28,52.95 arc2 62.9,53.97 arc-32 64.57,55.55 U69.4
N$55
  Top 0.152: U$2.61 61.39,52.45 arc56 61.67,52.6 arc2 62.84,54.46 arc-30 64.26,55.83 arc4 64.39,55.91 arc-46 U69.3
N$56
  Top 0.152: U$2.62 61.21,52.96 arc57 61.57,53.16 arc-8 63.25,55.52 arc-28 64.57,56.51 arc-35 U69.2
N$57
  Top 0.152: U$2.63 61.21,53.44 arc46 61.39,53.52 arc8 61.52,53.67 arc7 61.82,54.15 arc-30 64.47,56.92 arc-43 U69.1
N$58  (via drill 0.35)
  Top 0.152: U$2.66 58.11,54.38 58.12,54.36 58.12,52.21 58.05,52.13 v58.05,51.95 | v75.06,51.99 75.16,52.1 U69.38@2 U69.38@1
  Bottom 0.152: v75.06,51.99 73.66,51.99 73.48,52.17 58.27,52.17 v58.05,51.95
N$59  (via drill 0.35)
  Top 0.152: v73.89,52.64 73.93,52.6 U69.39@2 U69.39@1 | v57,51.78 57.82,52.6 57.82,54.24 57.61,54.45 U$2.67
  Bottom 0.152: v73.89,52.64 73.81,52.56 57.78,52.56 v57,51.78
N$60  (via drill 0.35)
  Top 0.152: v71.17,53.62 71.72,53.62 72.1,53.24 78.11,53.24 78.25,53.1 U69.40@2 U69.40@1 | U$2.68 57.11,54.26 57.52,53.86 57.52,53.35 56.96,52.79 v56.96,52.69
  Bottom 0.152: v71.17,53.62 70.99,53.44 57.63,53.44 56.96,52.77 v56.96,52.69
N$61  (via drill 0.35)
  Top 0.152: v72.08,54.12 72.6,53.6 U69.41@2 U69.41@1 | v56.91,53.6 56.86,53.65 56.86,54.07 56.61,54.32 U$2.69
  Bottom 0.152: v72.08,54.12 71.97,54.23 57.08,54.23 56.91,54.06 v56.91,53.6
N$62  (via drill 0.35)
  Top 0.152: v72.99,54.45 73.34,54.1 U69.42@2 U69.42@1 | v56.02,52.82 56.02,53.04 56.3,53.31 56.3,54.27 56.08,54.49 56.08,55.42 U$2.70
  Bottom 0.152: v72.99,54.45 72.71,54.72 56.71,54.72 56.3,54.32 56.3,53.3 56.02,53.02 v56.02,52.82
N$63  (via drill 0.35)
  Top 0.152: v73.67,55.05 74.12,54.6 U69.43@2 U69.43@1 | v55.69,53.67 55.6,53.76 U$2.71
  Bottom 0.152: v73.67,55.05 73.65,55.08 56.63,55.08 55.69,54.14 v55.69,53.67
N$64  (via drill 0.35)
  Top 0.152: v74.25,55.76 74.91,55.1 U69.44@2 U69.44@1 | v55.01,53.04 v55,53.04 55,53.89 55.11,53.99 U$2.72
  Bottom 0.152: v74.25,55.76 74.17,55.68 56.79,55.68 55.01,53.9 v55.01,53.04
N$65  (via drill 0.35)
  Top 0.152: v74.88,56.41 75.69,55.6 U69.45@2 U69.45@1 | U$2.73 54.61,53.95 v54.38,53.72
  Bottom 0.152: v74.88,56.41 74.85,56.39 57.05,56.39 v54.38,53.72
N$66  (via drill 0.35)
  Top 0.152: v74.19,57.02 74.27,57.1 U69.48@2 U69.48@1 | v54.1,56.97 U$2.74
  Bottom 0.152: v74.19,57.02 74.04,56.87 54.2,56.87 v54.1,56.97
N$67  (via drill 0.35)
  Top 0.152: v73.81,51.24 74.05,51 76.22,51 76.53,51.31 77.87,51.31 78.08,51.1 U69.36@2 U69.36@1 | v54.28,52.4 54.28,52.96 53.61,53.63 U$2.75
  Bottom 0.152: v54.28,52.4 54.28,52.35 55.68,50.94 67.29,50.94 67.59,51.24 v73.81,51.24
N$68  (via drill 0.35)
  Top 0.152: U$2.76 53.11,53.69 53.12,53.67 53.12,53.63 53.66,53.09 53.66,52.81 v53.43,52.81 | v77.62,50.71 77.72,50.6 79.15,50.6 U69.35@2 U69.35@1
  Bottom 0.152: v53.43,52.81 53.66,52.58 53.66,52.15 55.17,50.64 75.32,50.64 75.93,51.24 76.96,51.24 77.49,50.71 v77.62,50.71
N$69  (via drill 0.35)
  Top 0.152: v76.71,50.63 77.01,50.33 77.06,50.33 77.29,50.1 U69.34@2 U69.34@1 | U$2.77 52.61,53.75 52.82,53.54 52.82,52.18 v53.06,51.94
  Bottom 0.152: v76.71,50.63 75.75,50.63 75.45,50.33 54.7,50.33 53.09,51.94 v53.06,51.94
N$70  (via drill 0.35)
  Top 0.152: U$2.78 52.11,52.43 v52.21,52.43 | v76,50.03 76.93,50.03 77.34,49.62 79.26,49.62 U69.33@2 U69.33@1
  Bottom 0.152: v52.21,52.43 52.21,51.87 54.09,50 75.98,50 v76,50.03
N$71  (via drill 0.35)
  Top 0.152: v76.68,49.42 76.79,49.31 77.69,49.31 77.91,49.1 U69.32@2 U69.32@1 | v51.72,51.51 51.61,51.62 U$2.79
  Bottom 0.152: v76.68,49.42 54.06,49.42 52.2,51.28 51.95,51.28 v51.72,51.51
N$72  (via drill 0.35)
  Top 0.152: U$2.80 51.11,51.24 v51.75,50.6 | v77.44,48.71 77.55,48.6 79.17,48.6 U69.31@2 U69.31@1
  Bottom 0.152: v77.44,48.71 77.01,48.71 76.91,48.81 53.53,48.81 v51.75,50.6
N$73  (via drill 0.35)
  Top 0.152: v76.65,48.21 76.76,48.1 U69.30@2 U69.30@1 | v50.84,50.62 50.61,50.86 U$2.81
  Bottom 0.152: v76.65,48.21 53.13,48.21 50.78,50.56 v50.84,50.62
N$74  (via drill 0.35)
  Top 0.152: U$2.82 50.11,50.37 v50.77,49.71 | v75.98,47.6 79.15,47.6 | 79.15,47.6 U69.29@2 | U69.29@1 79.15,47.6
  Bottom 0.152: v50.77,49.71 52.88,47.6 v75.98,47.6
N$75  (via drill 0.35)
  Top 0.152: v76.66,46.99 76.77,47.1 U69.28@2 U69.28@1 | v49.86,49.73 49.61,49.99 U$2.83
  Bottom 0.152: v76.66,46.99 52.6,46.99 v49.86,49.73
N$76
  Top 0.152: U$1.6 73.06,24.25 69.19,28.12 62.41,28.12 56.11,34.42 U$2.33
N$77
  Top 0.152: R10.1 56.79,34.19 62.56,28.42 69.34,28.42 73.63,24.13 U$1.5
N$78
  Top 0.152: U$2.35 57.11,38.63 57.58,38.15 57.58,33.89 62.71,28.77 69.46,28.77 72.96,25.26 75.03,25.26 75.4,24.89 75.97,24.89 75.97,22.59 U$1.4
N$79
  Top 0.152: R9.1 58.27,33.7 62.86,29.11 69.54,29.11 73.05,25.6 76.09,25.6 U$1.3
N$80
  Top 0.152: U$2.34 56.61,38.49 56.8,38.3 R10.2
N$81
  Top 0.152: R9.2 58.27,38.06 57.61,38.73 U$2.36
N$82
  Top 0.152: U$1.2 79.07,24.23 77.39,25.91 73.17,25.91 69.64,29.44 63.02,29.44 58.95,33.51 58.95,38 58.62,38.32 58.62,38.33 58.11,38.85 U$2.37
N$83
  Top 0.152: U$1.31 42.86,31.48 arc45 43.61,33.28 43.61,34.72 | 43.61,34.72 U$2.8 | 43.61,34.72 R13.2
N$84
  Top 0.152: R12.2 44.3,35.38 | 44.3,35.38 R11.1 | 44.3,35.38 44.54,35.38 arc-45 45.03,35.18 45.03,32.23 arc-45 44.73,31.5 39.81,26.58 39.78,26.54 39.17,25.93 38.3,25.93 37.34,24.97 arc45 37.01,24.18 U$1.30
N$85
  Top 0.152: R11.2 44.3,37.88 arc-45 44.11,38.34 U$2.9
N$86
  Top 0.152: U$1.29 44.6,30.21 arc45 45.34,32.01 45.34,36.63 arc-45 44.98,37.49 44.98,38.34 arc-45 44.61,39.25 U$2.10
N$87
  Top 0.152: U$1.28 40.02,24.49 45.64,30.12 45.64,37.11 45.29,37.46 45.29,37.49 45.29,38.58 45.11,38.76 45.11,38.89 U$2.11
N$88  (via drill 0.35)
  Top 0.152: 23.73,81.13 23.73,81.61 24.17,82.05 U16.1 | 23.73,81.13 23.73,78.47 v23.74,78.46 23.78,78.5 24.31,77.96 24.31,76.29 U$4.73 | 23.73,81.13 22.3,82.55 22.3,83.08 20.6,84.79 R33.1
  Bottom 0.152: v23.74,78.46 23.73,78.47 23.73,81.61 24.17,82.05 U16.1
N$89
  Top 0.152: U$1.26 43.02,24.76 46.25,27.99 46.25,37.36 46.11,37.51 U$2.13
N$90
  Top 0.152: U$1.7 67.91,27.77 62.26,27.77 55.61,34.42 U$2.32
N$91
  Top 0.152: U$2.31 55.11,34.38 62.1,27.38 67.2,27.38 70.06,24.52 U$1.8
N$92
  Top 0.152: U$1.9 68.49,24.13 65.6,27.03 61.93,27.03 54.61,34.34 U$2.30
N$93
  Top 0.152: U$1.10 67.05,24.57 65.04,26.58 61.77,26.58 54.11,34.25 U$2.29
N$94
  Top 0.152: U$2.28 53.61,34.02 61.42,26.21 62.98,26.21 65.06,24.13 U$1.11
N$95
  Top 0.152: U$2.27 53.11,33.7 60.96,25.84 62.73,25.84 64.05,24.52 U$1.12
N$96
  Top 0.152: U$2.26 52.61,33.58 60.83,25.35 61.71,25.35 62.55,24.51 U$1.13
N$97
  Top 0.152: U$2.25 52.11,33.38 61.04,24.44 U$1.14
N$98
  Top 0.152: U$2.24 51.61,31.88 59.36,24.13 U$1.15
N$99
  Top 0.152: U$2.23 51.11,31.3 58.04,24.37 U$1.16
N$100
  Top 0.152: U$2.22 50.61,30.6 56.54,24.67 U$1.17
N$101
  Top 0.152: U$2.21 50.11,29.65 55.04,24.72 U$1.18
N$102
  Top 0.152: U$2.20 49.61,28.06 U$1.19
N$103
  Top 0.152: U$2.19 49.11,27.5 52.03,24.58 U$1.20
N$104
  Top 0.152: U$1.21 48.61,26.05 U$2.18
N$105
  Top 0.152: U$2.17 48.11,25.81 49.03,24.89 U$1.22
N$106
  Top 0.152: U$1.23 47.6,24.21 47.6,39.83 47.61,39.84 U$2.16
N$107
  Top 0.152: U$1.24 46.02,24.72 47.11,25.8 U$2.15
N$108
  Top 0.152: U$2.14 46.61,26.21 U$1.25
N$109
  Top 0.152: U$2.12 45.61,37.58 45.95,37.24 45.95,28.56 U$1.27
N$110  (via drill 0.35)
  Top 0.152: U$4.72 24.79,77.93 24.35,78.36 24.35,78.72 24.05,79.02 24.05,79.54 v24.35,79.85 | R28.1 21.79,84.23 22.91,83.11 v22.91,82.81 | 24.17,80.57 U16.5 24.17,80.04 v24.35,79.85 | 24.17,80.03 v24.35,79.85
  Route2 0.152: v22.91,82.81 22.91,81.94 23.72,81.13 23.72,80.26 24.14,79.85 v24.35,79.85
  Bottom 0.152: 24.32,79.85 v24.35,79.85 24.17,80.03 U16.5
N$111  (via drill 0.35)
  Top 0.152: U$4.71 25.29,77.38 25.11,77.56 25.11,78.4 25.36,78.65 25.36,79.03 | U16.4 25.57,79.26 25.39,79.09 | 25.39,79.09 25.36,79.06 25.36,79.03 | R30.1 22.99,83.9 23.32,83.56 v23.44,83.56 | 25.39,79.09 v25.39,79 25.36,79.03
  Route2 0.152: v23.44,83.56 23.62,83.38 23.62,82.35 24.6,81.37 25.41,81.37 25.57,81.21 25.57,79.18 v25.39,79
  Bottom 0.152: U16.4 25.57,79.18 v25.39,79
N$112  (via drill 0.35)
  Top 0.152: U$4.70 25.81,76.29 25.81,77.35 26,77.53 26,77.8 | 26,77.8 26,81.62 | U16.3 25.57,82.05 26,81.62 | 26,81.62 26,83.65 24.93,84.72 24.44,84.72 24.18,84.98 R29.1 | v25.73,77.98 25.82,77.98 26,77.8
  Bottom 0.152: U16.3 25.57,82.08 26.01,81.64 26.01,78.26 v25.73,77.98
N$113  (via drill 0.35)
  Top 0.152: U14.1 26.83,82.03 26.34,81.53 | U$4.69 26.3,76.28 26.3,77.15 26.34,77.19 26.34,78 | 26.34,81.53 26.34,78 | R36.1 25.37,84.71 26.34,83.74 26.34,81.53 | v26.75,78 26.34,78
  Bottom 0.152: U14.1 26.83,82.05 26.34,81.56 26.34,78.41 v26.75,78
N$114  (via drill 0.35)
  Top 0.152: U$4.68 26.81,76.29 26.81,77.03 27.37,77.58 27.37,78.99 v26.95,78.99 26.83,79.11 U14.5 | R31.1 26.31,85.38 v26.31,84.68
  Route2 0.152: v26.31,84.68 26.31,84.16 26.91,83.56 26.91,79.03 v26.95,78.99
  Bottom 0.152: U14.5 26.83,79.11 v26.95,78.99
N$115  (via drill 0.35)
  Top 0.152: 28.23,79.71 28.23,79.52 27.76,79.04 27.76,77.55 27.29,77.07 U$4.67 | 28.23,79.71 U14.4 | R43.2 28.05,85.42 v28.05,84.65 | v28.04,79.92 28.04,79.9 28.23,79.71
  Route2 0.152: v28.05,84.65 28.19,84.51 28.19,80.07 v28.04,79.92
  Bottom 0.152: U14.4 28.23,80.11 v28.04,79.92 | R43.2 28.05,85.42 v28.05,84.65
N$116  (via drill 0.35)
  Top 0.152: U14.3 28.25,82.98 28.25,82.02 28.66,81.6 | 28.66,81.6 28.66,77.98 | 28.66,77.98 28.66,77.89 27.81,77.04 27.81,76.29 U$4.66 | R32.1 29.06,84.91 28.66,84.52 28.66,81.6 | v28.4,78.03 28.61,78.03 28.66,77.98
  Bottom 0.152: U14.3 28.23,82.03 28.68,81.58 28.68,78.21 28.5,78.03 v28.4,78.03
N$117  (via drill 0.35)
  Top 0.152: U$4.65 28.31,76.29 28.31,77 29.01,77.7 29.01,78.03 | 29.01,78.03 29.01,81.46 29.03,81.48 | 29.03,81.48 29.58,82.03 U12.1 | 29.03,81.48 29.03,84.37 29.46,84.8 30.14,84.8 30.25,84.91 R35.1 | v29.36,78.03 29.01,78.03
  Bottom 0.152: U12.1 29.58,82.03 29.01,81.46 29.01,78.38 v29.36,78.03
N$118  (via drill 0.35)
  Top 0.152: 29.29,76.1 U$4.63 29.26,76.29 29.26,76.91 29.97,77.62 29.97,78.36 30.1,78.49 30.1,79.08 29.96,79.22 v29.61,79.22 29.61,80.95 U12.5 | R23.1 31.13,85.32 31.13,84.75 30.78,84.4 v30.78,84.02
  Route2 0.152: v30.78,84.02 29.65,82.9 29.65,79.26 v29.61,79.22
  Bottom 0.152: U12.5 29.58,79.26 v29.61,79.22
N$119  (via drill 0.35)
  Top 0.152: 29.79,76.11 U$4.62 29.79,76.98 30.28,77.47 30.29,77.47 30.29,78.22 30.79,78.72 v30.79,79.96 30.98,80.15 U12.4 | R24.1 31.75,84.77 v31.75,84.68
  Route2 0.152: v31.75,84.68 31.75,84.12 30.87,83.25 30.87,80.04 v30.79,79.96
  Bottom 0.152: U12.4 30.98,80.15 v30.79,79.96
N$120  (via drill 0.35)
  Top 0.152: U12.3 30.98,82.03 31.41,81.6 | 31.41,81.6 31.41,79.72 31.27,79.58 31.27,77.98 | 30.29,76.08 U$4.61 30.29,76.95 30.56,77.22 30.61,77.22 31.27,77.88 31.27,77.98 | 31.41,81.6 31.41,83.53 31.88,84 31.94,84 32.97,85.04 33.59,85.04 33.78,85.23 R22.1 | v30.91,77.98 31.27,77.98
  Bottom 0.152: U12.3 30.98,82.03 31.42,81.58 31.42,79.73 31.27,79.58 31.27,77.98 v30.91,77.98
N$121  (via drill 0.35)
  Top 0.152: 31.71,81.61 31.71,79.49 31.6,79.37 31.6,78.03 | U10.1 32.22,82.12 31.71,81.61 | 30.79,76.11 U$4.60 30.79,76.96 31.6,77.77 31.6,78.03 | R25.1 34.96,85.63 34.06,84.73 33.1,84.73 32.07,83.7 32.01,83.7 31.71,83.4 31.71,81.61 | v31.95,78.03 31.6,78.03
  Bottom 0.152: U10.1 32.22,82.12 | U10.1 32.21,83 | v31.95,78.03 31.6,78.03 31.6,79.4 31.72,79.53 31.72,81.64 32.22,82.13 U10.1
N$122  (via drill 0.35)
  Top 0.152: U10.5 32.21,81 v32.21,78.92 32.21,78.9 32.79,78.32 U$4.56 | v34.85,84.65 35.26,85.06 35.52,85.06 36.1,85.63 R21.1
  Route2 0.152: v34.85,84.65 34.85,83.67 34.16,82.98 32.59,82.98 32.32,82.72 32.32,79.03 v32.21,78.92
  Bottom 0.152: 32.22,79.1 32.21,79.08 v32.21,78.92 | 32.22,79.1 U10.5 32.34,80.9 | 32.22,79.1
N$123  (via drill 0.35)
  Top 0.152: 33.62,79.86 33.62,78.96 33.1,78.44 33.1,77.19 33.29,77 U$4.55 | 33.62,79.86 U10.4 | R26.1 36.34,84.61 v35.94,84.61 | v33.44,79.86 33.62,79.86
  Route2 0.152: v33.44,79.86 33.22,80.07 33.22,81.41 35.94,84.12 v35.94,84.61
  Bottom 0.152: U10.4 33.62,79.86 v33.44,79.86
N$124  (via drill 0.35)  (1 unrouted)
  Top 0.152: 33.79,76.21 33.79,76.97 34.05,77.23 34.05,78 | 34.05,81.85 33.62,82.28 U10.3 34.25,83.64 v34.25,83.95 | 34.05,81.85 34.05,78 | R20.1 38.49,85.63 36.86,84.01 35.19,84.01 34.05,82.87 34.05,81.85 | v33.71,78.05 34,78.05 34.05,78
  Bottom 0.152: v34.25,83.95 34.25,83.64 U10.3 33.63,83.01 33.63,82.27 34.06,81.84 34.06,78.18 33.93,78.05 v33.71,78.05
N$125
  Top 0.152: R17.1 39.51,70.22 38.81,69.52 37.03,69.52 U$4.40
N$126
  Top 0.152: Y1.1 41.5,72.64 41.22,72.36 40.36,72.36 40.31,72.42 | 40.31,72.42 R17.2 | 40.31,72.42 C16.1
N$127
  Bottom 0.203: U$6.5 3.35,12.84 arc-45 2.63,13.14 arc-45 2.11,14.41 2.11,29.69 arc45 R60.2
N$133
  Top 0.813: L1.2 94.49,13.23 98.79,8.93 U$3.1
N$134
  Top 0.152: L2.1IN 100.86,22.78 102.24,24.15 102.24,26.9 102.54,27.2 102.9,27.2 102.92,27.23 R5.1 C2.1
N$135
  Top 0.152: L3.3IN 104.5,23.06 103.73,23.82 103.73,26.95 103.99,27.2 104.45,27.2 104.5,27.25 R4.1 C3.1
N$137
  Top 0.152: R6.1 101.52,24.05 100.81,23.34 100.05,23.34 99.26,22.56 L2.2IN
N$138
  Top 0.152: R56.1 36.87,50.76 36.87,48.95 38.59,48.95 U$2.113
  Top 0.203: R55.2 R56.1
N$151  (via drill 0.35)
  Top 0.203: v7.26,35.37 7.49,35.37 8.23,34.63 v8.23,28.79
  Bottom 0.152: 4.1,36.68 3.95,36.83 R54.1 | C26.1 4.04,35.84 4.04,36.68 | U7.1 6.42,36.55 6.19,36.78 4.61,36.78 4.57,36.82 4.57,37.38 4.45,37.5 3.1,37.5 2.73,37.13 D2.A
  Bottom 0.203: D2.A 2.76,36.23 3.42,36.23 3.86,36.68 4.04,36.68 4.1,36.68 | U7.1 6.42,35.14 6.58,34.98 6.87,34.98 v7.26,35.37 | v8.23,28.79 7.58,28.79 7.34,28.55 7.34,28.01 R19.1
N$152
  Bottom 0.203: U$6.4 14.3,12.84 arc-45 14.96,12.56 arc-45 15.11,12.19 15.11,11.32 arc-45 14.83,10.64 14.72,10.53 arc-45 14.41,10.4 C25.1
N$154
  Bottom 0.254: R19.2 6.21,26.69 Q2.P$2
N$155
  Bottom 0.203: Q1.P$2 6.46,29.4 4.71,29.4
  Bottom 0.254: Q2.P$1 4.71,29.4 R18.2
N$158
  Bottom 0.203: C24.1 17.83,43.95 18.3,44.42 18.3,45.11 17.98,45.44 U5.4
N$160  (via drill 0.35)
  Top 0.406: L4.2@1 8.05,40.58 | 8.05,40.58 7.65,40.58 | 7.65,40.58 6.84,40.58 D1.P$2 | 7.95,41.68 v7.33,41.06 D1.P$2 | 7.95,41.68 v8.2,41.68 9.32,41.68 | L4.2@2 7.06,38.2 6.74,38.52 | 6.74,38.52 v6.43,38.83 D1.P$2 | D1.P$2 6.57,40.17 7.18,39.56 7.65,40.03 7.65,40.58 | 7.93,38.84 7.3,39.46 6.74,38.9 6.74,38.52 | 7.95,41.68 8.05,41.58 8.05,40.58
  Bottom 0.305: v6.43,38.83 6.42,38.82 6.42,37.74 | U7.5 6.42,37.89 5.79,38.52 5.79,39.01 6.29,39.51
  Bottom 0.406: 7.95,41.68 v8.2,41.68
  pour Bottom: 6.17,38.63 6.17,40.23 7.89,41.95 8.43,41.95 9.18,41.2 6.62,38.63
N$168  (via drill 0.35)
  Top 0.152: L2.1OUT 100.84,17.81 100.84,9.17 99.84,8.17 v99.84,6.87
  Bottom 0.152: U$3.4 100.79,2.83 99.97,2.02 98.26,2.02 97.71,2.57 97.71,5.66 98.3,6.25 99.21,6.25 v99.84,6.87
N$169  (via drill 0.35)
  Top 0.152: L2.2OUT 99.26,11.98 v99.8,11.44 | v102.64,8.22 102.78,8.08 U$3.5
  Bottom 0.152: v99.8,11.44 102.64,8.6 v102.64,8.22
N$170
  Top 0.203: U$3.3 100.79,7.7 104.5,11.4 L3.3OUT
N$171
  Top 0.152: L3.2OUT 106.1,10.24 104.08,8.22 104.08,2.59 103.3,1.82 99.67,1.82 98.79,2.7 U$3.2
N$172
  Top 0.152: L3.2IN 106.1,23.01 105.38,23.72 105.38,26.99 105.61,27.23 106.1,27.23 | 106.07,28.25 R3.1 105.98,28.13 105.98,27.95 106.1,27.84 106.1,27.23 | 106.1,27.23 106.1,26.3 C4.1
PIN3  (via drill 0.5)
  Top 0.152: R27.2 v39.75,88.95
PIN4  (via drill 0.5)
  Top 0.152: R20.2 v38.56,88.95
PIN5  (via drill 0.5)
  Top 0.152: R26.2 v37.36,88.95
PIN6  (via drill 0.5)
  Top 0.152: R21.2 v36.17,88.95
PIN7  (via drill 0.5)
  Top 0.152: R25.2 v34.98,88.95
PIN8  (via drill 0.5)
  Top 0.152: R22.2 v33.78,88.95
PIN9  (via drill 0.5)
  Top 0.152: R24.2 v32.61,88.95
PIN10  (via drill 0.5)
  Top 0.152: R23.2 v31.45,88.95
PIN13  (via drill 0.5)
  Top 0.152: R35.2 v30.25,88.95
PIN15  (via drill 0.5)
  Top 0.152: R32.2 v29.06,88.95
PIN16  (via drill 0.5)
  Top 0.152: R34.2 v27.84,88.95
PIN17  (via drill 0.5)
  Top 0.152: R31.2 v26.57,88.95
PIN19  (via drill 0.5)
  Top 0.152: R36.2 v25.37,88.95
PIN21  (via drill 0.5)
  Top 0.152: R29.2 v24.18,88.95
PIN23  (via drill 0.5)
  Top 0.152: R30.2 v22.99,88.95
PIN25  (via drill 0.5)
  Top 0.152: R28.2 v21.79,88.95
PIN34  (via drill 0.5)
  Top 0.152: v20.6,88.95 R33.2 20.56,86.93 R42.1
S2  (via drill 0.35)  (1 unrouted)
  Top 0.813: D1.P$1 5.18,35.61 | 5.18,30.81 5.18,35.52 6.39,34.32 v6.57,34.32 6.57,33.36 arc-45 7.16,31.92 C21.+ | 5.18,30.81 5.18,29.79 | 5.18,29.79 5.18,28.7 | 5.18,28.7 5.18,27.94 5.18,23.86 arc45 5.93,22.07 7.23,20.76 arc45 9.58,19.79 81.63,19.79 arc45 83.98,20.76 84,20.78 arc45 84.48,21.95 U$1.S2 | C21.+ 6.74,31.45 arc-45 5.18,30.81 | C21.+ arc45 5.61,31.24 5.18,30.81 | 5.18,29.79 7.09,31.7 arc45 C21.+ | 5.18,28.7 6.42,29.94 arc45 7.16,31.74 C21.+ | 7.16,30.97 C21.+
  Bottom 0.254: U7.2 5.72,34.79
  other vias: 5.16,34.56
  pour Bottom: 6.93,34.95 4.78,34.95 4.78,33.17 6.93,33.17
SC  (via drill 0.35)
  Top 0.152: U$4.10 27.79,54.69 v27.89,54.58 | v57.25,41.96 57.27,41.94 U$2.40 | R6.2 101.52,27.08 R2.1
  Top 0.203: v83.82,34.06 83.89,34 U9.4 | 101.52,27.08 98.43,27.08 v96.75,28.75
  Route2 0.152: v27.89,54.58 27.89,53.95 39.88,41.96 v57.25,41.96
  Route2 0.203: v57.25,41.96 57.63,41.58 76.3,41.58 v83.82,34.06
  Bottom 0.203: v96.75,28.75 94.34,31.17 86.72,31.17 v83.82,34.06 83.89,34 U9.4
SD  (via drill 0.35)
  Top 0.203: U$2.41 61.27,42.44 61.75,41.96 61.75,40.26 63.04,38.96 68.72,38.96 69.15,38.53 v69.75,38.53 | v102.9,31.27 102.9,29.43 R5.2
  Bottom 0.203: v69.75,38.53 70.31,38.53 74.88,33.96 82.58,33.96 83.36,34.75 84.38,34.75 86.59,32.54 101.63,32.54 v102.9,31.27
SI  (via drill 0.35)
  Top 0.152: U$2.42 v56.5,42.94 v56.49,42.93 | U$4.13 29.29,59.72 30.1,58.9 v30.1,58.27
  Top 0.203: U9.3 83.89,29.75 v83.9,29.74 | R4.2 104.5,31.32 v104.45,31.37
  Route2 0.152: v56.49,42.93 40.26,42.93 30.1,53.09 v30.1,58.27
  Route15 0.203: v83.9,29.74 84.68,30.53 84.68,34.16 | 84.68,34.16 84.07,34.77 83.79,34.77 76.43,42.14 65.05,42.14 64.31,42.88 63.73,42.88 63.56,42.7 59.99,42.7 58.47,44.22 57.63,44.22 57.02,43.61 57.02,43.43 56.53,42.94 arc-45 v56.49,42.93 | v104.45,31.37 102.72,33.1 85.75,33.1 84.68,34.16
  Bottom 0.203: v83.9,29.74 83.89,29.75 U9.3
SO  (via drill 0.35)
  Top 0.152: 59.14,43.44 U$2.43 | U$4.12 28.79,59.78 29.49,59.08 v29.49,57.58
  Top 0.203: v82.47,29.74 82.47,30.76 U9.1 | v57.97,43.55 58.07,43.44 59.14,43.44 | v106.02,30.91 106.07,30.86 R3.2
  Route2 0.152: v29.49,57.58 29.49,53.08 40.26,42.32 56.74,42.32 v57.97,43.55
  Route15 0.203: v87.43,30.38 99.47,30.38 100.79,31.7 101.73,31.7 102.18,31.24 102.18,30.96 102.54,30.61 106.02,30.61 v106.02,30.91
  Bottom 0.203: v57.97,43.55 63.64,43.55 77.62,29.57 82.3,29.57 v82.47,29.74 82.49,29.75 U9.1 82.49,31.53 82.65,31.7 85.29,31.7 86.61,30.38 v87.43,30.38
SW1  (via drill 0.35)  (1 unrouted)
  Top 0.203: U$4.42 35.63,70.53 35.18,70.08 v35.18,69.98 | U19.P$1 25.48,15.27 v25.35,15.39
  Bottom 0.305: U$1.CARTSW1 61.5,12.98 46.89,12.98 | 46.89,12.98 46,12.98 | 46.89,12.98 46.89,12.4 46.33,11.84 27.23,11.84 25.35,13.72 v25.35,15.39 25.35,61.79 33.54,69.98 v35.18,69.98
U18
  Top 0.152: U$4.53 34.29,77.04 34.35,77.1 34.35,80.58 | 34.35,80.58 34.35,82.31 35.71,83.67 37.52,83.67 38.79,84.94 39.8,84.94 39.8,85.58 R27.1 | U18.P$1 34.47,80.63 arc45 34.35,80.58
U20  (via drill 0.35)
  Top 0.203: R1.1 30,4.52 v29.95,4.47 | v34.52,71.2 35.99,71.2 36.16,71.03 U$4.43 | U20.P$1 v24.99,11.33
  Bottom 0.203: v29.95,4.47 28.65,4.47 24.99,8.13 v24.99,11.33
  Bottom 0.254: v24.99,11.33 24.88,11.33 24.28,11.93 24.28,62.05 33.43,71.2 v34.52,71.2
VDD2  (via drill 0.35, 0.4)
  Top 0.152: U$2.117 37.14,46.94 v37.05,47.03 | U$2.115 38.59,47.95 37.52,47.95 37.16,48.31 v37.05,48.31 | U$2.65 58.61,57.08 v59.16,57.63 | U69.12 66.89,51.6 v66.93,51.56 | U69.37@2 U69.37@1 84.54,51.6 v84.58,51.64
  Top 0.254: U$2.44 60.98,43.94 arc-45 61.65,43.66 arc45 61.74,43.45 62.08,43.1 63.02,43.1 | 63.02,43.1 63.35,43.1 arc-45 63.65,42.98 63.74,42.89 arc-45 v64.01,42.24 | C9.1 62.99,43.04 arc-45 63.02,43.1
  Route2 0.305: v66.93,51.56 66.93,57.78
  Bottom 0.254: C6.2 36.99,47.09 v37.05,47.03 | C7.2 37.02,48.34 v37.05,48.31 | v84.58,51.64 C8.1
  Bottom 0.305: v59.16,57.63 C10.1
  Bottom 0.406: 15.65,17.49 v15.65,17.51
  Bottom 0.508: v15.63,18.43 11.27,18.43 11.27,17.53 U$6.1 15.65,17.49
  other vias: 15.66,16.59 26.75,18.22 27.75,18.22 28.75,18.21 29.68,18.21 19.74,18.33 19.74,17.41 19.74,16.5
  pour Route2: 38.86,59.94 84.02,59.94 92.07,51.89 92.07,6.96 88.14,3.02 27.91,3.02 26.34,4.6 26.34,47.42
  pour Top: 14.91,14.27 23.72,14.27 23.72,17.35 30.47,17.35 30.47,19.06 14.91,19.06
  pour Bottom: 14.67,19.1 20.83,19.1 20.83,14.87 14.67,14.87
VDD3  (via drill 0.35)  (2 unrouted)
  Top 0.203: C11.2 39.18,39 arc-90 v39.45,39.27
  Top 0.254: U$2.1 U$2.1 arc-90 v39.45,39.27 | U$2.124 v36.8,43.44 arc90 v36.79,43.43 | U$2.103 37.04,53.94 arc-90 v36.93,54.05 | R13.1 arc90 41,34.38 v41,33.73
  Top 0.406: v14.86,34.9 13.93,35.83 L4.1@1
  Top 1.016: C17.+ 30.55,28.93 arc-90 30.66,28.83 arc90 31.42,28.07 33.44,28.07 36.14,28.07 | v10.16,32.14 v10.16,31.2 10.63,31.67 14.07,31.67 14.07,31.15
  Bottom 0.152: v36.93,54.05 37.29,54.41 38.37,54.41 38.8,54.84 C12.2
  Bottom 0.254: v39.45,39.27 39.55,39.27 arc-90 40.16,38.66
  Bottom 0.61: v36.79,43.43 34.77,43.43 arc-90 34.72,43.48
  Bottom 1.016: 41,28.07 v34.95,28.07 | 41,28.07 85.02,28.07 arc-90 88.5,24.59 U$1.S1 | 41,28.07 v41,33.73 41,35 arc90 40.16,35.84 40.16,38.56 v39.45,39.27 38.48,39.27 37.71,40.04 36.08,40.04 34.72,41.4 34.72,43.48 34.72,44.81 arc-90 33.63,45.9 33.63,51.69 arc-90 35.81,53.87 36.75,53.87 v36.93,54.05
  other vias: 16.79,31.39 15.39,30.51 15.54,28.93 19.05,41.94 20.7,41.94 14.76,40.01 35.99,28.07
  pour Route2: 15.34,26.52 18.82,26.52 18.82,36.88 21.46,36.88 21.46,41.91 21.46,42.95 13.87,42.95 13.87,26.52
  pour Top (rank 2, hatched): 14.1,39.32 13.82,39.6 13.82,40.23 16.26,42.67 21.51,42.67 21.51,41.3 20.9,40.69 20.85,40.64 18.54,40.64 15.95,38.05 14.38,38.05 14.12,38.3 14.12,39.24 14.12,39.29
  pour Top: 17.3,28.02 17.3,31.78 13.87,31.78 13.87,28.02
  pour Bottom (rank 2): 10.54,30.68 8.13,30.68 8.13,32.49 10.54,32.49
  pour Top (rank 2): 10.54,32.49 8.97,32.49 8.97,30.68 10.54,30.68
VDD35  (via drill 0.35)  (1 unrouted)
  Top 0.203: U$2.38 58.61,39.07 arc45 58.71,38.83 arc-45 59.81,38.37 C13.1
  Top 0.406: v83.19,29.11 81.07,26.99 arc-45 79.28,26.25 79.01,26.25 | 86.03,24.71 arc-45 85.57,25.82 C5.2 | R2.2 v101.52,30.73
  Top 0.508: R12.1 44.3,32.27 arc-45 v44.12,31.84 | C13.1 arc45 59.83,37.49 v59.83,36.7
  Top 0.813: L1.1 94.44,19.31 v94.44,20.47 v94.44,21.34 C1.2
  Top 1.016: U$1.C1 86.49,23.6 arc45 86.03,24.71 arc45 84.19,25.48 80.05,25.48 arc45 79.97,25.29 | v63.02,37.77 v63.83,37.77 65.79,37.77 arc-45 68.69,36.57 79.01,26.25 79.97,25.29 | 79.97,25.29 80.23,25.03 arc45 80.75,24.82 80.63,24.54 U$1.1
  Bottom 0.305: v83.19,29.11 U8.2
  Bottom 1.016: U$1.C1 86.49,21.52 arc45 87.24,19.72 87.35,19.61 arc45 87.6,19.51 93.76,19.51 arc45 94.44,19.79 v94.44,20.47 v94.44,21.34 94.44,25.02 95.14,25.02 arc45 96.94,25.77 101.52,30.35 v101.52,30.73 | v63.83,37.77 v63.02,37.77 arc-45 62.64,36.86 62.52,36.74 arc-45 62.43,36.7 v59.83,36.7 59.83,33.52 arc-45 59.51,32.75 59.28,32.52 arc-45 57.51,31.79 44.16,31.79
YEET  (via drill 0.35)
  Top 0.203: v35.46,73.15 arc-45 35.76,73.03 U$4.47
  Route15 0.203: v2.36,41.66 2.36,50.75 arc-45 3.11,52.55 22.84,72.28 arc-45 24.94,73.15 v35.46,73.15
  Bottom 0.152: R54.2 3.34,38.77 D2.C
  Bottom 0.203: R60.1 2.11,38.76 | 2.11,38.76 2.11,41.04 arc-45 v2.36,41.66 | 2.11,38.76 arc-45 2.12,38.77 D2.C

## Text on the board
tNames: Vin | GND | JChalka (Joey Chalker) / GameboyPlayerPortable / gPP | EXT PIN